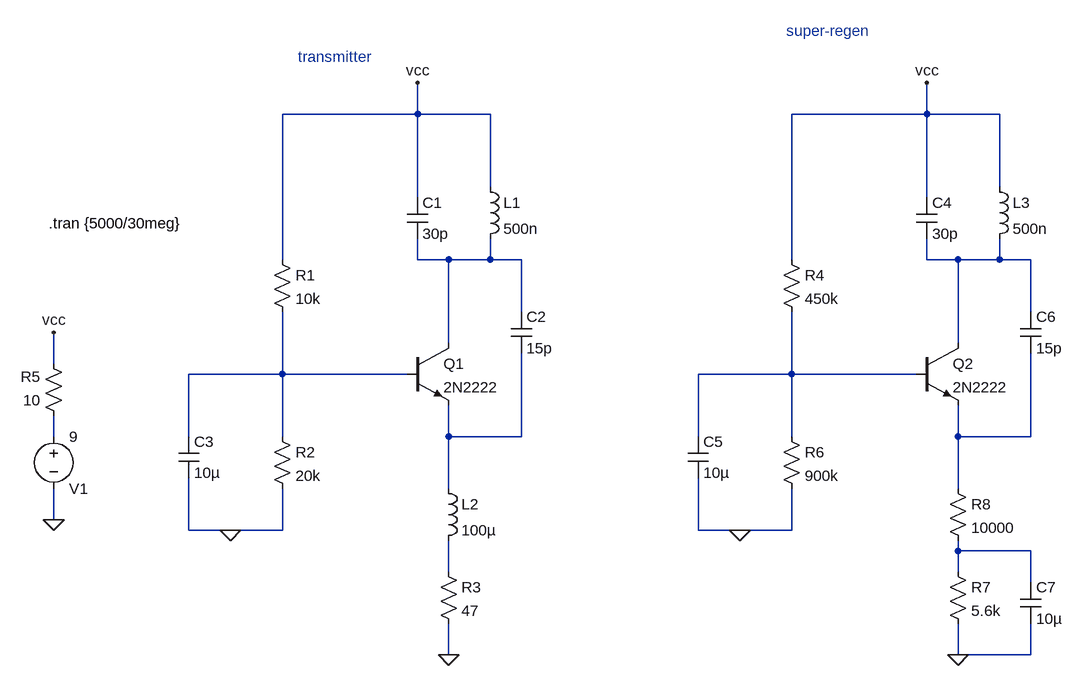
[diagram p0: schematic osc-basecomun.asc]
osc-basecomun.asc, the LTspice schematic file:
Version 4
SHEET 1 1160 696
WIRE 144 -192 144 -240
WIRE 144 -192 -64 -192
WIRE 256 -192 144 -192
WIRE 928 -192 928 -240
WIRE 928 -192 720 -192
WIRE 1040 -192 928 -192
WIRE 256 -80 256 -192
WIRE 1040 -80 1040 -192
WIRE 144 -64 144 -192
WIRE 928 -64 928 -192
WIRE -64 32 -64 -192
WIRE 144 32 144 0
WIRE 192 32 144 32
WIRE 256 32 256 0
WIRE 256 32 192 32
WIRE 304 32 256 32
WIRE 720 32 720 -192
WIRE 928 32 928 0
WIRE 976 32 928 32
WIRE 1040 32 1040 0
WIRE 1040 32 976 32
WIRE 1088 32 1040 32
WIRE 304 112 304 32
WIRE 1088 112 1088 32
WIRE 192 160 192 32
WIRE 976 160 976 32
WIRE -416 192 -416 144
WIRE -64 208 -64 112
WIRE -64 208 -208 208
WIRE 128 208 -64 208
WIRE 720 208 720 112
WIRE 720 208 576 208
WIRE 912 208 720 208
WIRE -416 304 -416 272
WIRE -208 304 -208 208
WIRE -64 304 -64 208
WIRE 192 304 192 256
WIRE 304 304 304 176
WIRE 304 304 192 304
WIRE 576 304 576 208
WIRE 720 304 720 208
WIRE 976 304 976 256
WIRE 1088 304 1088 176
WIRE 1088 304 976 304
WIRE 192 384 192 304
WIRE 976 384 976 304
WIRE -416 432 -416 384
WIRE -208 448 -208 368
WIRE -144 448 -208 448
WIRE -64 448 -64 384
WIRE -64 448 -144 448
WIRE 576 448 576 368
WIRE 640 448 576 448
WIRE 720 448 720 384
WIRE 720 448 640 448
WIRE 976 480 976 464
WIRE 1088 480 976 480
WIRE 192 512 192 464
WIRE 976 512 976 480
WIRE 1088 528 1088 480
WIRE 192 640 192 592
WIRE 976 640 976 592
WIRE 1088 640 1088 592
WIRE 1088 640 976 640
FLAG -144 448 0
FLAG 192 640 0
FLAG -416 432 0
FLAG -416 144 vcc
FLAG 144 -240 vcc
FLAG 640 448 0
FLAG 976 640 0
FLAG 928 -240 vcc
SYMBOL res -80 16 R0
SYMATTR InstName R1
SYMATTR Value 10k
SYMBOL res -80 288 R0
SYMATTR InstName R2
SYMATTR Value 20k
SYMBOL res 176 496 R0
SYMATTR InstName R3
SYMATTR Value 47
SYMBOL cap 128 -64 R0
SYMATTR InstName C1
SYMATTR Value 30p
SYMBOL cap -224 304 R0
SYMATTR InstName C3
SYMATTR Value 10µ
SYMBOL ind 240 -96 R0
SYMATTR InstName L1
SYMATTR Value 500n
SYMBOL voltage -416 288 R0
WINDOW 0 24 96 Left 2
WINDOW 3 24 16 Left 2
WINDOW 123 0 0 Left 0
WINDOW 39 0 0 Left 0
SYMATTR InstName V1
SYMATTR Value 9
SYMBOL npn 128 160 R0
SYMATTR InstName Q1
SYMATTR Value 2N2222
SYMBOL res -400 288 R180
WINDOW 0 36 76 Left 2
WINDOW 3 36 40 Left 2
SYMATTR InstName R5
SYMATTR Value 10
SYMBOL cap 288 112 R0
SYMATTR InstName C2
SYMATTR Value 15p
SYMBOL ind 176 368 R0
SYMATTR InstName L2
SYMATTR Value 100µ
SYMBOL res 704 16 R0
SYMATTR InstName R4
SYMATTR Value 450k
SYMBOL res 704 288 R0
SYMATTR InstName R6
SYMATTR Value 900k
SYMBOL res 960 496 R0
SYMATTR InstName R7
SYMATTR Value 5.6k
SYMBOL cap 912 -64 R0
SYMATTR InstName C4
SYMATTR Value 30p
SYMBOL cap 560 304 R0
SYMATTR InstName C5
SYMATTR Value 10µ
SYMBOL ind 1024 -96 R0
SYMATTR InstName L3
SYMATTR Value 500n
SYMBOL npn 912 160 R0
SYMATTR InstName Q2
SYMATTR Value 2N2222
SYMBOL cap 1072 112 R0
SYMATTR InstName C6
SYMATTR Value 15p
SYMBOL res 960 368 R0
SYMATTR InstName R8
SYMATTR Value 10000
SYMBOL cap 1072 528 R0
SYMATTR InstName C7
SYMATTR Value 10µ
TEXT -424 -24 Left 2 !.tran {5000/30meg}
TEXT 712 -320 Left 2 ;super-regen
TEXT -40 -280 Left 2 ;transmitter

The netlist it stands for:
* osc-basecomun.asc
R1 vcc N003 10k
R2 N003 0 20k
R3 N009 0 47
C1 vcc N001 30p
C3 N003 0 10µ
L1 vcc N001 500n
V1 N005 0 9
Q1 N001 N003 N006 0 2N2222
R5 N005 vcc 10
C2 N001 N006 15p
L2 N006 N009 100µ
R4 vcc N004 450k
R6 N004 0 900k
R7 N008 0 5.6k
C4 vcc N002 30p
C5 N004 0 10µ
L3 vcc N002 500n
Q2 N002 N004 N007 0 2N2222
C6 N002 N007 15p
R8 N007 N008 10000
C7 N008 0 10µ
.model NPN NPN
.model PNP PNP
.lib standard.bjt
.tran {5000/30meg}
* super-regen
* transmitter
.backanno
.end